# EAGLE design MastModule (EAGLE 9.6.2)
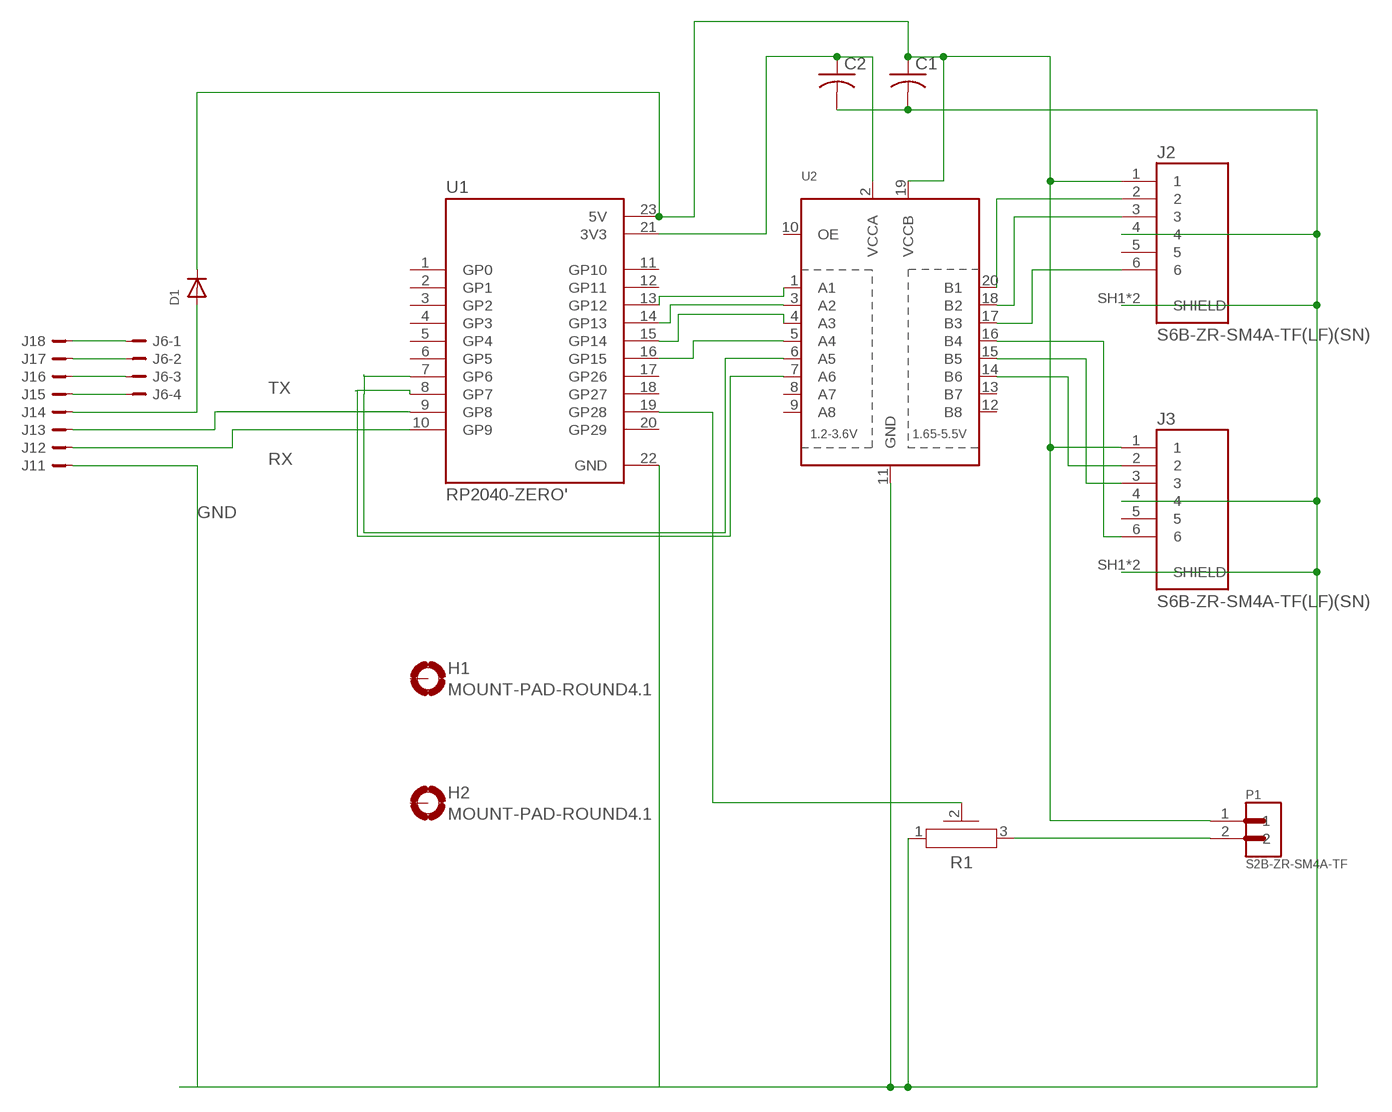
[diagram p0: schematic, sheet 1]

## Parts
C1  C-USC1210  [C1210]
C2  C-USC1210  [C1210]
D1  DIODESMA  [SMADIODE]
H1  MOUNT-PAD-ROUND4.1  [4,1-PAD]
H2  MOUNT-PAD-ROUND4.1  [4,1-PAD]
J1  B8B-PH-K-S  [B8B-PH-K-S]
J2  S6B-ZR-SM4A-TF(LF)(SN)  [JST_S6B-ZR-SM4A-TF(LF)(SN)]
J3  S6B-ZR-SM4A-TF(LF)(SN)  [JST_S6B-ZR-SM4A-TF(LF)(SN)]
J6  JST-PH-4_TH-RA  [S4B-PH-KL]
P1  S2B-ZR-SM4A-TF  [JST_S2B-ZR-SM4A-TF]
R1  PV36X  [PV36X]
U1  RP2040-ZERO'  [MODULE_RP2040-ZERO]
U2  TXB0108PWR  [TSSOP20]

## Nets
GND: C1.2 C2.2 J1.1 J2.4 J2.SH1(SHIELD) J2.SH2(SHIELD) J3.4 J3.SH1(SHIELD) J3.SH2(SHIELD) R1.1 U1.22(GND) U2.11(GND)
N$1: J1.8 J6.1
N$2: J1.7 J6.2
N$3: J1.6 J6.3
N$4: J1.5 J6.4
N$5: C2.1 U1.21(3V3) U2.2(VCCA)
N$6: D1.A J1.4
N$8: J2.2 U2.20(B1)
N$9: J2.3 U2.18(B2)
N$10: R1.2 U1.19(GP28)
N$11: P1.2 R1.3
N$12: J2.6 U2.17(B3)
N$13: J3.6 U2.16(B4)
N$14: J3.3 U2.15(B5)
N$15: J3.2 U2.14(B6)
N$21: U1.8(GP7) U2.7(A6)
N$22: U1.7(GP6) U2.6(A5)
N$23: U1.13(GP12) U2.1(A1)
N$24: U1.14(GP13) U2.3(A2)
N$25: U1.15(GP14) U2.4(A3)
N$26: U1.16(GP15) U2.5(A4)
N$27: C1.1 D1.C J2.1 J3.1 P1.1 U1.23(5V) U2.19(VCCB)
RX: J1.2 U1.10(GP9)
TX: J1.3 U1.9(GP8)
Unconnected: H1.B4,1(MOUNT) H2.B4,1(MOUNT) J2.5 J3.5 U1.1(GP0) U1.2(GP1) U1.3(GP2) U1.4(GP3) U1.5(GP4) U1.6(GP5) U1.11(GP10) U1.12(GP11) U1.17(GP26) U1.18(GP27) U1.20(GP29) U2.8(A7) U2.9(A8) U2.10(OE) U2.12(B8) U2.13(B7)

## Library data of the parts
C1 C2 = adafruit:C-US: CAPACITOR, American symbol
D1 = adafruit:DIODE: Diode SMADIODE - SMA Surface Mount Package 20V 1A Schottky Diode Digikey: 641-1014-6-ND DO-1N4148 - Through Hole Small Current Diode SOD-123 20V 1 A (.5mV Vf) Schottky Diode - Digikey: MBRX120TPMSCT-ND SOD-323 10V 570mA (.38mV Vf, 3ns) Schottky Diode - Digikey: ZLLS410CT-ND SOD-523 30V 30mA Schottky Diode (RB751S-40TE61) - Digikey: RB751S-40TE61CT-ND SOT23-R/W - SOT23 Package (R = Solder Paste/Reflow Ovens, W = Hand-Soldering) BAT54Film 40V 300mA - Digikey: 497-7162-1-ND
H1 H2 = holes:MOUNT-PAD-ROUND: MOUNTING PAD, round
J1 = con-JST-PH:B8B-PH-K-S: JST-PH 8-way vertical TH
J2 J3 = S6B-ZR-SM4A-TF_LF__SN_:S6B-ZR-SM4A-TF(LF)(SN): Check availability <https://pricing.snapeda.com/parts/S6B-ZR-SM4A-TF%28LF%29%28SN%29/JST%20Sales%20America%20Inc./view-part?ref=eda>; AVAILABILITY: In Stock; CHECK_PRICES: https://www.snapeda.com/parts/S6B-ZR-SM4A-TF(LF)(SN)/JST/view-part/?ref=eda; DESCRIPTION: Connector Header Surface Mount, Right Angle 6 position 0.059 (1.50mm); MF: JST Sales America Inc.; MP: S6B-ZR-SM4A-TF(LF)(SN); PACKAGE: None; PRICE: None; SNAPEDA_LINK: https://www.snapeda.com/parts/S6B-ZR-SM4A-TF(LF)(SN)/JST/view-part/?ref=snap
J6 = con-JST-PH:JST-PH-4; MF: JST; MPN: S4B-PH-KL
P1 = S2B-ZR-SM4A-TF:S2B-ZR-SM4A-TF: Check availability <https://pricing.snapeda.com/parts/S2B-ZR-SM4A-TF/JST%20Sales/view-part?ref=eda>; AVAILABILITY: In Stock; CHECK_PRICES: https://www.snapeda.com/parts/S2B-ZR-SM4A-TF/JST/view-part/?ref=eda; DESCRIPTION: Connector Header Surface Mount, Right Angle 2 position 0.059 (1.50mm); MF: JST Sales; MP: S2B-ZR-SM4A-TF; PACKAGE: None; PRICE: None; SNAPEDA_LINK: https://www.snapeda.com/parts/S2B-ZR-SM4A-TF/JST/view-part/?ref=snap
R1 = Resistor:PV36: Rectangular Trimmer Potentiometers - PV36 Series Reference: Datasheet <https://www.bourns.com/docs/Product-Datasheets/pv36.pdf>; CATEGORY: Potentiometers; DATASHEET: https://www.bourns.com/docs/Product-Datasheets/pv36.pdf; DESCRIPTION: 0.5W 1/2W PC Pins Through Hole Trimmer Potentiometer Cermet 25.0 Turn Side Adjustment; MANUFACTURER: Bourns Inc.; MPN: PV36Xx; OPERATING_TEMPERATURE: -55°C ~ 125°C; PACKAGE_SIZE: NA; PACKAGE_TYPE: THT; PART_STATUS: ACTIVE; ROHS: COMPLIANT; SERIES: PV36; SUBCATEGORY: Trimmer Potentiometers; TEMPERATURE_COEFFICIENT: ±100ppm/°C; THERMALLOSS: 0.5 W; TOLERANCE: ±10%; TYPE: Side Adjustment Inline Leads
U1 = RP2040-ZERO:RP2040-ZERO: Check availability <https://pricing.snapeda.com/parts/RP2040-ZERO/Waveshare%20Electronics/view-part?ref=eda>; AVAILABILITY: Not in stock; CHECK_PRICES: https://www.snapeda.com/parts/RP2040-ZERO/Waveshare+Electronics/view-part/?ref=eda; DESCRIPTION: Low-Cost, High-Performance Pico-Like MCU Board Based On Raspberry Pi Microcontroller RP2040; MF: Waveshare Electronics; MP: RP2040-ZERO; PACKAGE: Package; PRICE: None; SNAPEDA_LINK: https://www.snapeda.com/parts/RP2040-ZERO/Waveshare+Electronics/view-part/?ref=snap
U2 = adafruit:TXB0108PWR: 8-Bit Bi-Directional Level Shifter 1.2V-3.6V (VCCA) to 1.65V-5.5V (VCCB) bi-directional level shifter with auto direction sensing. Max data rate - VCCA 1.8V: 20Mbps (50ns), VCCA 3.3V: 100Mbps (10ns) Digikey: 296-21527-1-ND

## Board
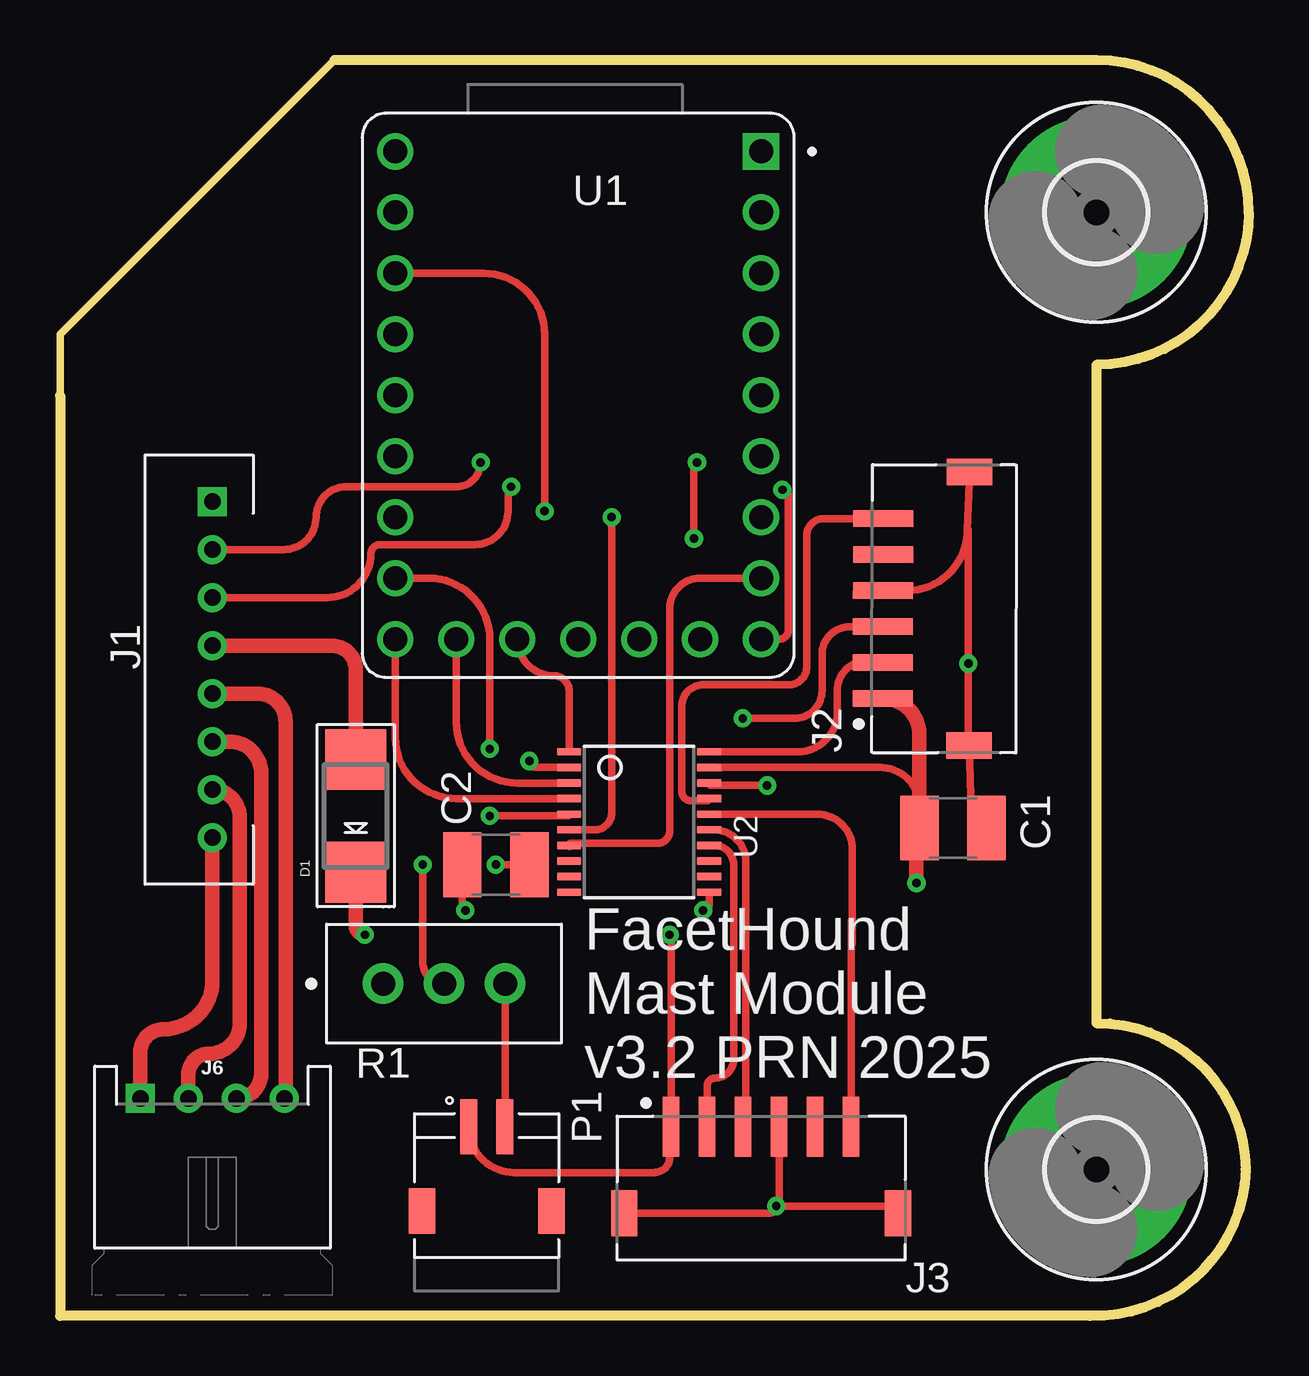
[diagram p1: board, top side]
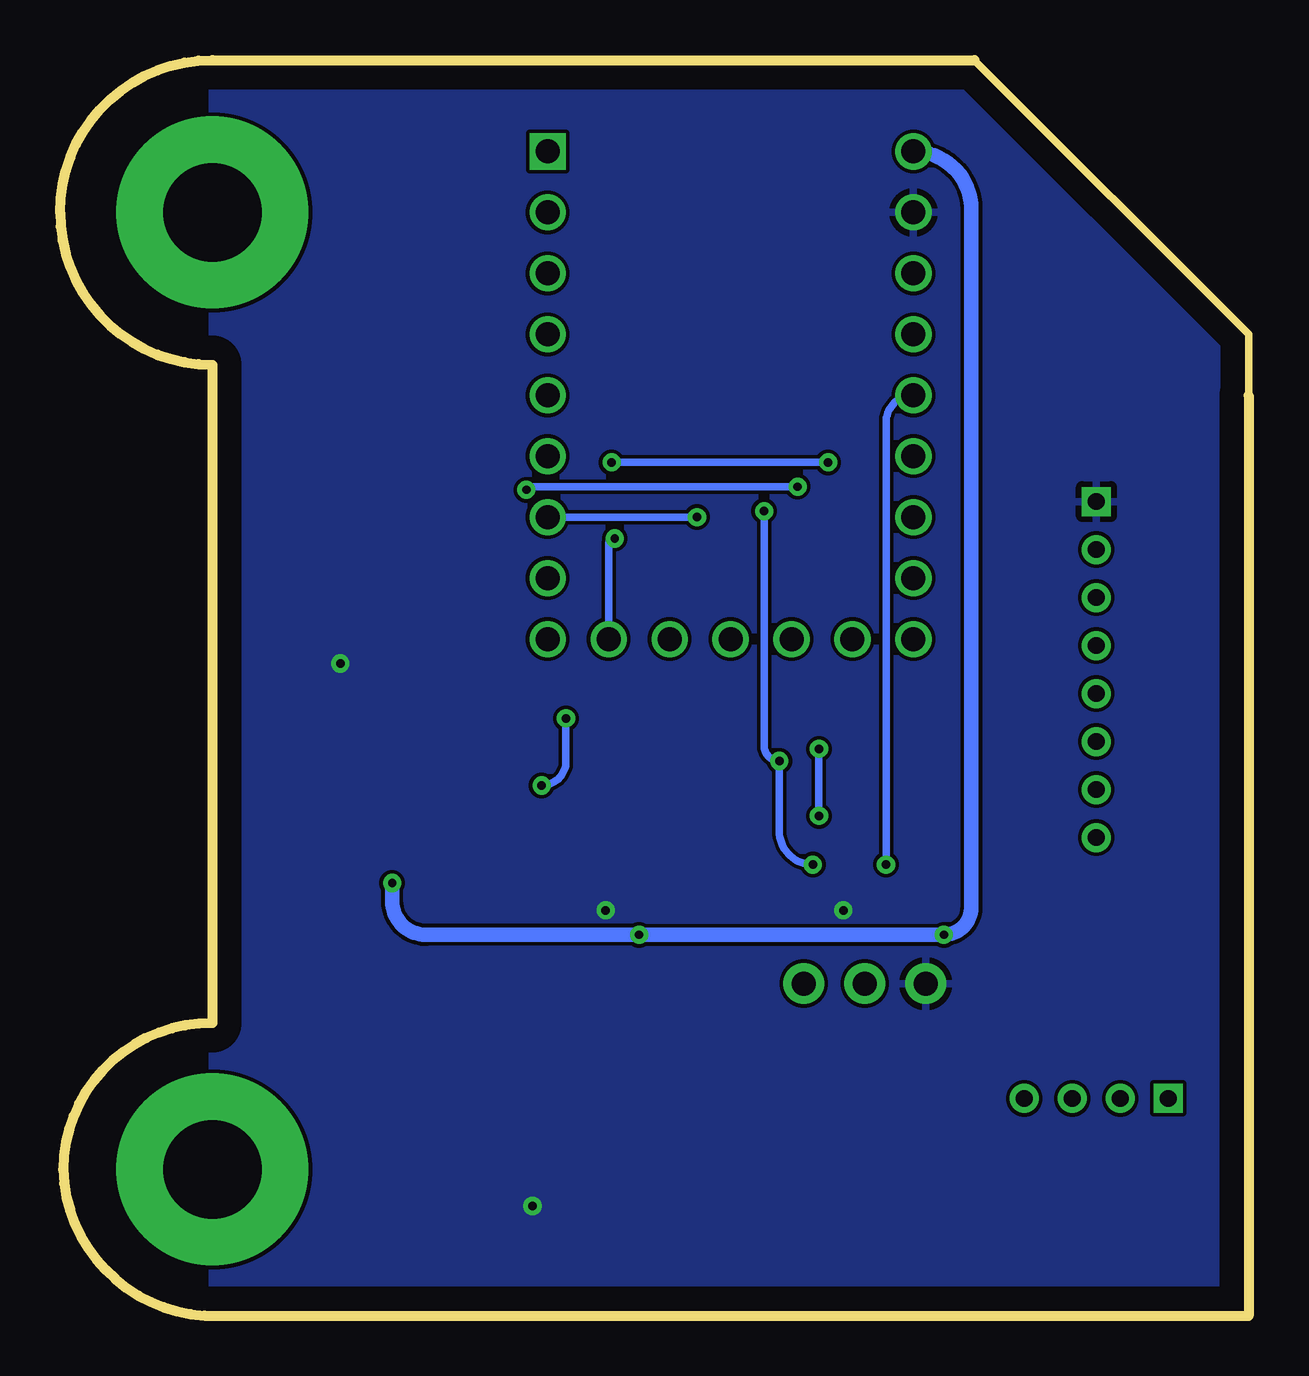
[diagram p2: board, bottom side, seen from below]

Size 49.53 x 52.32 mm. Coordinates in mm from the lower left corner, seen from the top.
Outline: 0,38.35 0,0 42.93,0 arc90 49.4,6.1 arc90 43.18,12.19 43.18,39.62 arc90 49.53,45.97 arc90 43.18,52.32 11.43,52.32 0,40.89 0,38.35
Copper layers (1*16): Top 0.035mm / dielectric 1.5mm / Bottom 0.035mm
Design rules "default": minimum track width 6mil, minimum drill 0.35mm, track to track 6mil, track to pad 6mil, pad to pad 6mil, via to via 6mil, smd to smd 6mil, copper to edge 40mil, drill to drill 6mil, minimum pad ring 10mil, minimum via ring 8mil, stop-mask expansion 4mil, vias tented up to drill 0mil, thermal gap 10mil

### Footprints (pad centres in the part's own frame; a part is rotated, then mirrored left to right if it is on the bottom)
C1210 = smd 1.6 x 2.7: 1 -1.4,0; 2 1.4,0
SMADIODE = smd 2.54 x 2.54: A 2.349,0; C -2.349,0
4,1-PAD = drill 4.1 pad 8: B4,1 0,0
B8B-PH-K-S = drill 0.7 square: 1 7,0 | drill 0.7: 2 5,0; 3 3,0; 4 1,0; 5 -1,0; 6 -3,0; 7 -5,0; 8 -7,0
JST_S6B-ZR-SM4A-TF(LF)(SN) = smd 0.7 x 2.5: 1 -3.75,0; 2 -2.25,0; 3 -0.75,0; 4 0.75,0; 5 2.25,0; 6 3.75,0 | smd 1.1 x 1.9: SH1 -5.7,-3.6; SH2 5.7,-3.6
S4B-PH-KL = drill 0.7 square: 1 3,-3.72 | drill 0.7: 2 1,-3.72; 3 -1,-3.72; 4 -3,-3.72
JST_S2B-ZR-SM4A-TF = smd 0.7 x 2.3: 1 0.75,0; 2 -0.75,0 | smd 1.1 x 1.9: P1 2.7,3.5; P2 -2.7,3.5
PV36X = drill 1 pad 1.7: 1 0,0; 2 2.54,0; 3 5.08,0
MODULE_RP2040-ZERO = drill 1 square: 1 7.62,10.16 | drill 1: 2 7.62,7.62; 3 7.62,5.08; 4 7.62,2.54; 5 7.62,0; 6 7.62,-2.54; 7 7.62,-5.08; 8 7.62,-7.62; 9 7.62,-10.16; 10 5.08,-10.16; 11 2.54,-10.16; 12 0,-10.16; 13 -2.54,-10.16; 14 -5.08,-10.16; 15 -7.62,-10.16; 16 -7.62,-7.62; 17 -7.62,-5.08; 18 -7.62,-2.54; 19 -7.62,0; 20 -7.62,2.54; 21 -7.62,5.08; 22 -7.62,7.62; 23 -7.62,10.16
TSSOP20 = smd 0.305 x 0.991: 1 -2.925,-2.918; 2 -2.275,-2.918; 3 -1.625,-2.918; 4 -0.975,-2.918; 5 -0.325,-2.918; 6 0.325,-2.918; 7 0.975,-2.918; 8 1.625,-2.918; 9 2.275,-2.918; 10 2.925,-2.918; 11 2.925,2.918; 12 2.275,2.918; 13 1.625,2.918; 14 0.975,2.918; 15 0.325,2.918; 16 -0.325,2.918; 17 -0.975,2.918; 18 -1.625,2.918; 19 -2.275,2.918; 20 -2.925,2.918

### Placement (x,y rotation side)
C1  37.21,20.32 0 top
C2  18.16,18.8 180 top
D1  12.32,20.83 90 top
H1  43.18,45.97 0 top
H2  43.18,6.1 0 top
J1  6.35,26.92 90 top
J2  34.29,29.46 89.9 top
J3  29.21,7.87 0 top
J6  6.35,5.33 180 top
P1  17.78,7.87 180 top
R1  13.46,13.84 0 top
U1  21.59,38.35 0 top
U2  24.13,20.57 270 top

### Tracks (layer width: path | path; a pad name or v marks a point on that pad's centre or on a via)
GND  (via drill 0.35)
  Top 0.305: U2.11 27.05,17.14 arc-90 v26.8,16.89 | C1.2 arc-90 37.97,20.96 J2.SH1 arc-90 37.85,23.94 v37.85,27.18 37.85,32.72 arc90 37.81,32.75 | J2.4 35.27,30.21 arc90 37.81,32.75 | 37.81,32.75 J2.SH2 | J3.SH1 29.55,4.27 arc90 v29.84,4.57 | J3.4 29.96,4.69 arc-90 v29.84,4.57 | v29.84,4.57 34.61,4.57 arc-90 J3.SH2 | C2.2 16.76,16.89 v16.89,16.89
  Top 0.406: 23.47,4.32 arc-90 J3.SH1
  pour Bottom: 11.43,52.32 0,40.89 0,0.25 43.18,0.25 43.18,52.32
N$1
  Top 0.61: J1.8 6.35,13.97 arc-90 4.32,11.94 arc90 3.35,10.97 J6.1
N$2
  Top 0.61: J1.7 arc-90 7.49,20.78 7.49,12.19 arc-90 6.22,10.92 arc90 5.35,10.05 J6.2
N$3
  Top 0.61: J1.6 7.06,23.92 arc-90 8.38,22.61 8.38,10.09 arc-90 J6.3
N$4
  Top 0.61: J1.5 8.24,25.92 arc-90 9.4,24.77 9.4,9.1 arc-90 J6.4
N$5  (via drill 0.35)
  Top 0.305: v19.56,23.11 arc90 19.82,22.85 U2.2 | v20.19,33.53 20.19,40.89 arc90 17.65,43.43 U1.21 | v18.16,18.8 C2.1
  Bottom 0.305: v20.19,33.53 20.19,23.75 arc-90 v19.56,23.11 19.56,20.19 arc-90 v18.16,18.8
N$6
  Top 0.61: D1.A 12.32,26.92 arc90 11.32,27.92 J1.4
N$8
  Top 0.305: U2.20 30.74,23.5 arc90 32.39,25.15 32.39,26.04 arc-90 33.66,27.3 34.23,27.3 arc-90 J2.2
N$9  (via drill 0.35)
  Top 0.305: J2.3 32.91,28.71 arc90 31.75,27.56 31.75,26.04 arc-90 30.61,24.89 v28.45,24.89 | v29.46,22.1 27.15,22.1 arc-90 U2.18
  Bottom 0.305: v28.45,24.89 28.45,23.11 arc90 v29.46,22.1
N$10  (via drill 0.35)
  Top 0.305: v15.11,18.8 15.11,14.73 arc90 R1.2
  Bottom 0.305: U1.19 arc-90 15.11,37.21 v15.11,18.8
N$11
  Top 0.305: P1.2 arc90 18.54,7.89 R1.3
N$12
  Top 0.305: J2.6 31.82,33.21 arc90 31.11,32.51 31.11,27.05 arc-90 30.35,26.29 26.8,26.29 arc90 25.91,25.4 25.91,21.84 arc90 26.29,21.46 26.96,21.46 arc90 U2.17
N$13
  Top 0.305: 32.96,16.44 32.96,15.49 | 32.96,15.49 J3.6 | 32.96,15.49 arc90 33.02,15.55 33.02,19.43 arc90 31.55,20.9 U2.16
N$14
  Top 0.305: 26.98,20.25 U2.15 27.25,20.25 arc-90 28.58,18.92 28.58,7.99 arc-90 J3.3
N$15
  Top 0.305: U2.14 27.26,19.6 arc-90 28.07,18.8 28.07,10.67 arc-90 27.31,9.91 arc90 26.96,9.56 J3.2
N$21
  Top 0.305: 21.25,19.56 arc-90 U2.7 arc-90 21.3,19.68 24.89,19.68 arc90 25.4,20.19 25.4,29.46 arc-90 26.67,30.73 U1.8
N$22  (via drill 0.35)
  Top 0.305: U2.6 22.28,20.25 arc90 22.99,20.95 v22.99,33.27
  Bottom 0.305: U1.7 v22.99,33.27
N$23
  Top 0.305: U1.13 arc90 20.57,26.67 arc-90 21.21,26.03 U2.1
N$24
  Top 0.305: U1.14 16.51,24.74 arc90 19.05,22.2 U2.3
N$25
  Top 0.305: U1.15 13.97,24.09 arc90 16.51,21.55 U2.4
N$26  (via drill 0.35)
  Top 0.305: U1.16 15.37,30.73 arc-90 17.91,28.19 v17.91,23.62 | v17.91,20.83 21.14,20.83 arc90 U2.5
  Bottom 0.305: v17.91,23.62 v17.91,20.83
N$27  (via drill 0.35)
  Top 0.305: U2.19 34.17,22.85 arc-90 35.81,21.21 | C1.1 35.56,20.32 | J3.1 25.46,8.25 | 25.46,8.25 25.46,15.81 arc90 v25.4,15.88 | P1.1 arc90 18.94,5.97 24.77,5.97 arc90 25.4,6.6 25.4,8.2 arc-90 25.46,8.25
  Top 0.61: v35.69,18.03 35.69,20.19 arc90 35.56,20.32 | C1.1 35.81,21.21 35.81,24.25 arc90 J2.1 | v12.7,15.88 arc-90 12.32,16.26 D1.C
  Bottom 0.61: U1.23 arc90 11.56,46.1 11.56,17.02 | v12.7,15.88 v25.4,15.88 34.29,15.88 | 34.29,15.88 34.42,15.88 | 34.29,15.88 arc90 35.69,17.27 v35.69,18.03 | 11.56,17.02 arc90 v12.7,15.88 | 11.56,17.02 arc90 v12.7,15.88
RX  (via drill 0.35)
  Top 0.305: v26.42,32.38 26.42,35.43 arc-90 v26.54,35.56 | v17.53,35.56 arc-90 16.51,34.54 11.94,34.54 arc90 10.67,33.27 arc-90 9.32,31.92 J1.2
  Bottom 0.305: U1.10 26.67,32.13 arc90 v26.42,32.38 | v26.54,35.56 v17.53,35.56
TX  (via drill 0.35)
  Top 0.305: v18.8,34.54 arc90 18.67,34.42 18.67,33.53 arc-90 17.27,32.13 13.34,32.13 arc90 12.95,31.75 arc-90 11.13,29.92 J1.3 | v30.1,34.42 arc-90 30.35,34.16 30.35,28.58 arc-90 29.97,28.19 U1.9
  Bottom 0.305: v30.1,34.42 arc90 29.97,34.54 v18.8,34.54

### Text on the board
tPlace: FacetHound / Mast Module / v3.2 PRN 2025